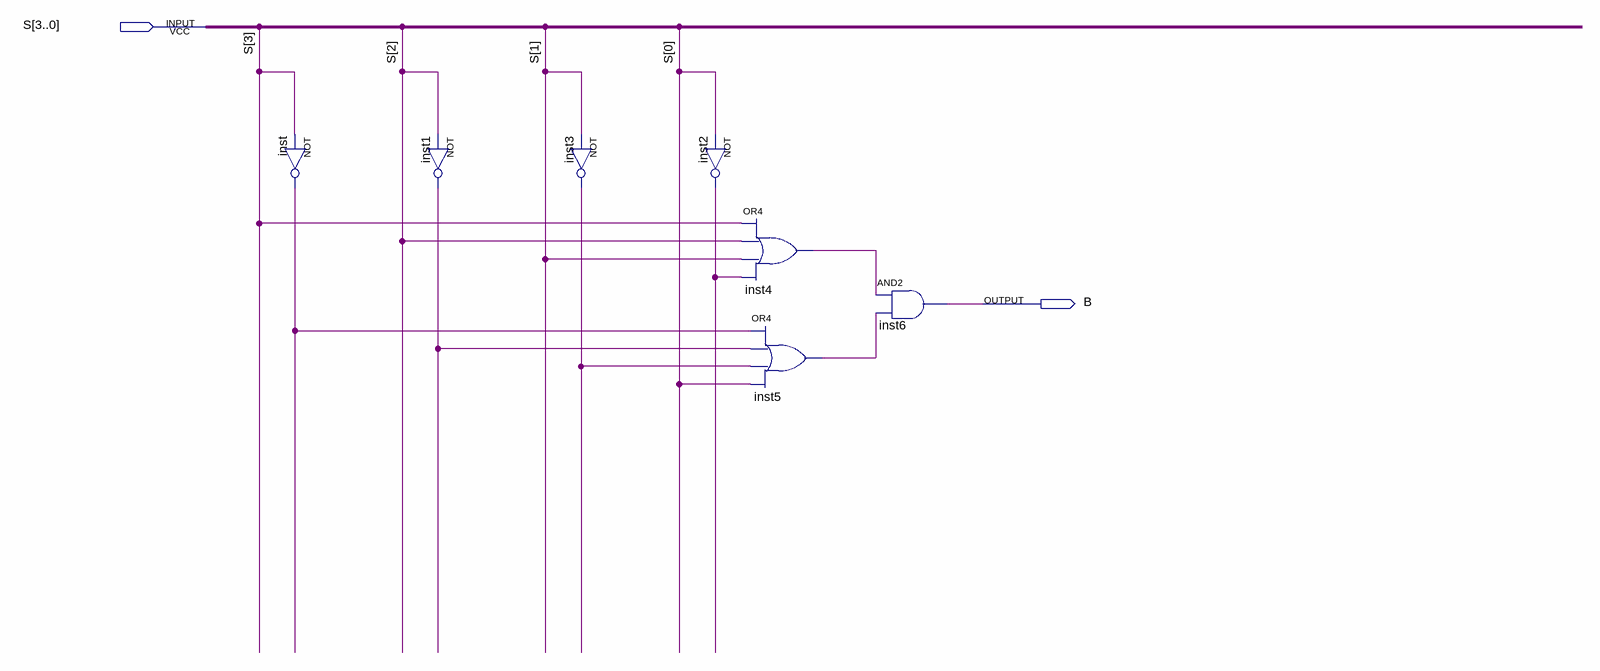
[diagram p0: schematic sheet]
// Quartus schematic DisplayB.bdf as structural Verilog: 7 symbols, 2 pins
module DisplayB (
  input  [3:0] S,
  output B
);

  wire inst1_out, inst2_out, inst3_out, inst4_out, inst5_out, inst_out;

  not inst (inst_out, S[3]);
  not inst1 (inst1_out, S[2]);
  not inst3 (inst3_out, S[1]);
  not inst2 (inst2_out, S[0]);
  or inst4 (inst4_out, S[3], S[2], S[1], inst2_out);
  or inst5 (inst5_out, inst_out, inst1_out, inst3_out, S[0]);
  and inst6 (B, inst4_out, inst5_out);
endmodule
